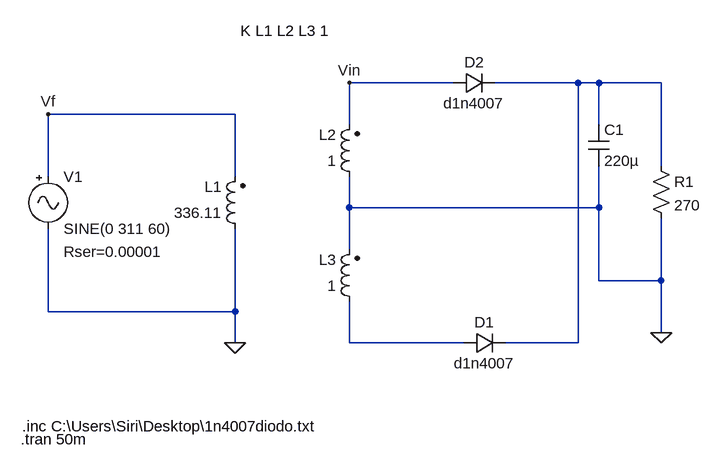
[diagram p0: schematic SimulacaoRelatorio2Parte3Cap220.asc]
SimulacaoRelatorio2Parte3Cap220.asc, the LTspice schematic file:
Version 4
SHEET 1 884 680
WIRE 496 -16 336 -16
WIRE 688 -16 560 -16
WIRE 720 -16 688 -16
WIRE 816 -16 720 -16
WIRE 160 32 -128 32
WIRE 336 48 336 -16
WIRE 720 48 720 -16
WIRE 816 112 816 -16
WIRE -128 128 -128 32
WIRE 160 128 160 32
WIRE 336 176 336 128
WIRE 720 176 720 112
WIRE 720 176 336 176
WIRE 336 240 336 176
WIRE 720 288 720 176
WIRE 816 288 816 192
WIRE 816 288 720 288
WIRE -128 336 -128 208
WIRE 160 336 160 208
WIRE 160 336 -128 336
WIRE 816 368 816 288
WIRE 160 384 160 336
WIRE 336 384 336 320
WIRE 512 384 336 384
WIRE 688 384 688 -16
WIRE 688 384 576 384
FLAG 160 384 0
FLAG -128 32 Vf
FLAG 816 368 0
FLAG 336 -16 Vin
SYMBOL Misc\\signal -128 112 R0
WINDOW 123 0 0 Left 0
WINDOW 39 24 132 Left 2
SYMATTR InstName V1
SYMATTR Value SINE(0 311 60)
SYMATTR SpiceLine Rser=0.00001
SYMBOL ind2 176 224 R180
WINDOW 0 36 80 Left 2
WINDOW 3 36 40 Left 2
SYMATTR InstName L1
SYMATTR Value 336.11
SYMATTR Type ind
SYMBOL ind2 352 144 R180
WINDOW 0 36 80 Left 2
WINDOW 3 36 40 Left 2
SYMATTR InstName L2
SYMATTR Value 1
SYMATTR Type ind
SYMBOL ind2 352 336 R180
WINDOW 0 36 80 Left 2
WINDOW 3 36 40 Left 2
SYMATTR InstName L3
SYMATTR Value 1
SYMATTR Type ind
SYMBOL diode 512 400 R270
WINDOW 0 32 32 VTop 2
WINDOW 3 0 32 VBottom 2
SYMATTR InstName D1
SYMATTR Value d1n4007
SYMBOL diode 496 0 R270
WINDOW 0 32 32 VTop 2
WINDOW 3 0 32 VBottom 2
SYMATTR InstName D2
SYMATTR Value d1n4007
SYMBOL res 800 96 R0
SYMATTR InstName R1
SYMATTR Value 270
SYMBOL cap 704 48 R0
SYMATTR InstName C1
SYMATTR Value 220µ
TEXT 168 -96 Left 2 !K L1 L2 L3 1
TEXT -168 512 Left 2 !.inc C:\\Users\\Siri\\Desktop\\1n4007diodo.txt
TEXT -170 532 Left 2 !.tran 50m

The netlist it stands for:
* SimulacaoRelatorio2Parte3Cap220.asc
V1 Vf 0 SINE(0 311 60) Rser=0.00001
L1 0 Vf 336.11
L2 0 Vin 1
L3 N002 0 1
D1 N002 N001 d1n4007
D2 Vin N001 d1n4007
R1 N001 0 270
C1 N001 0 220µ
.model D D
.lib standard.dio
K L1 L2 L3 1
.inc C:\Users\Siri\Desktop\1n4007diodo.txt
.tran 50m
.backanno
.end